# Altium schematic sheet MCU.SchDoc
size A; SheetNumber: 2; SheetTotal: 9
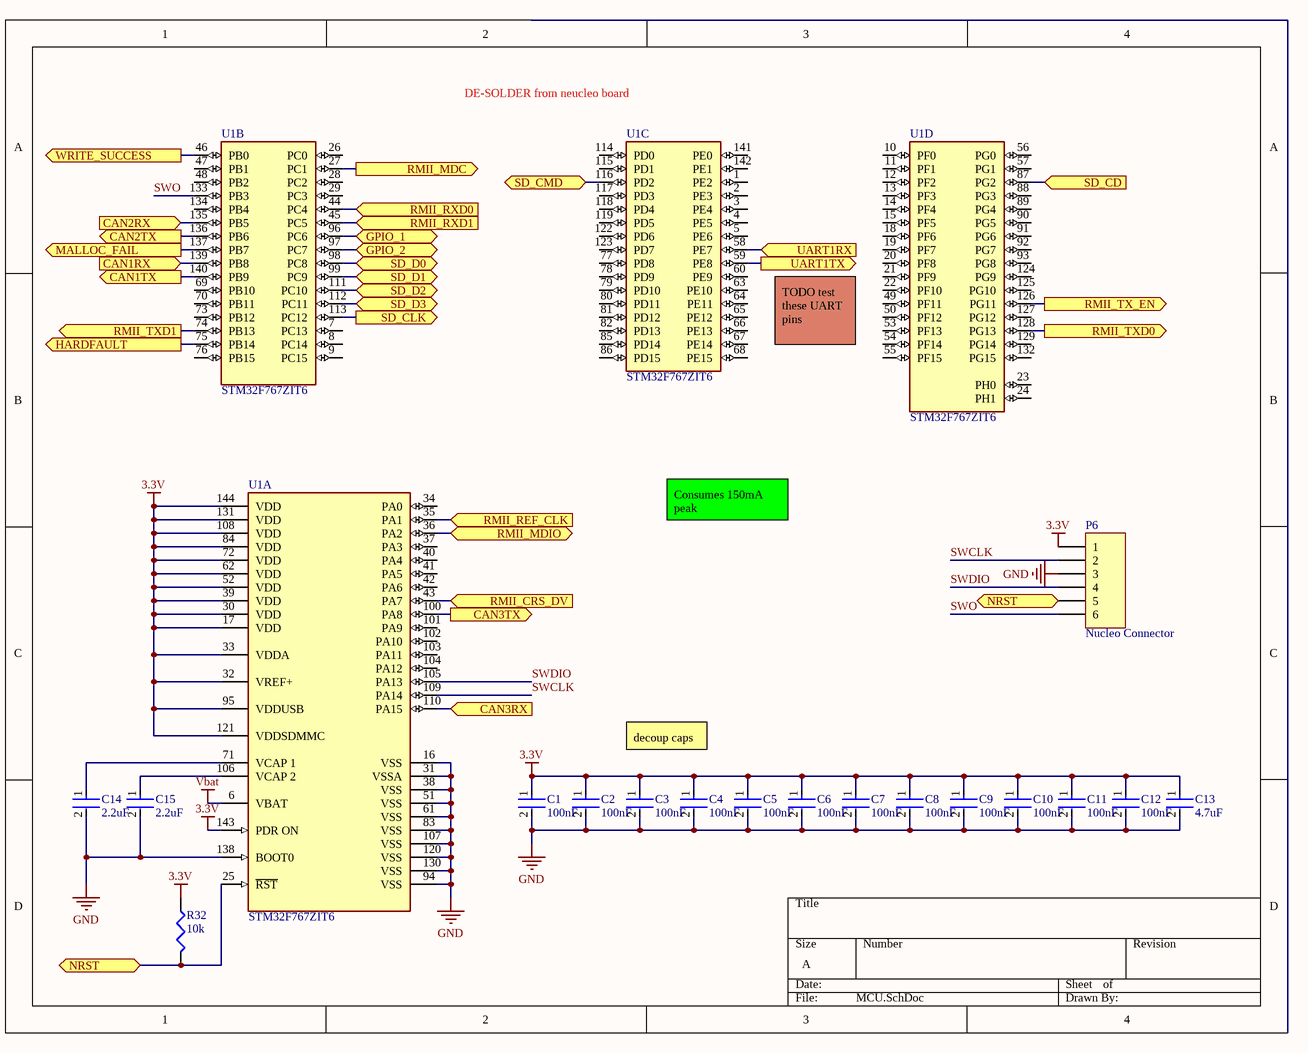
[diagram p0: MCU.SchDoc]

## Parts
C1  100nF  [FP-C0603C-CF-MFG]
C2  100nF  [FP-C0603C-CF-MFG]
C3  100nF  [FP-C0603C-CF-MFG]
C4  100nF  [FP-C0603C-CF-MFG]
C5  100nF  [FP-C0603C-CF-MFG]
C6  100nF  [FP-C0603C-CF-MFG]
C7  100nF  [FP-C0603C-CF-MFG]
C8  100nF  [FP-C0603C-CF-MFG]
C9  100nF  [FP-C0603C-CF-MFG]
C10  100nF  [FP-C0603C-CF-MFG]
C11  100nF  [FP-C0603C-CF-MFG]
C12  100nF  [FP-C0603C-CF-MFG]
C13  4.7uF  [FP-C0603C-CF-MFG]
C14  2.2uF  [FP-C0603C-CF-MFG]
C15  2.2uF  [FP-C0603C-CF-MFG]
P6  Nucleo Connector  [HDR1X6]
R32  10k  [J1-0603]
U1  STM32F767ZIT6  [FP-LQFP144-1A-MFG]  (parts A,B,C,D of 4)

## Ports
CAN1RX (in), CAN1TX (out), CAN2RX (in), CAN2TX (out), CAN3RX (in), CAN3TX (out), GPIO_1 (bidir), GPIO_2 (bidir), HARDFAULT (out), MALLOC_FAIL (out), NRST (bidir), RMII_CRS_DV (in), RMII_MDC (out), RMII_MDIO (bidir), RMII_REF_CLK (in), RMII_RXD0 (in), RMII_RXD1 (in), RMII_TX_EN (out), RMII_TXD0 (out), RMII_TXD1 (out), SD_CD (in), SD_CLK (out), SD_CMD (bidir), SD_D0 (bidir), SD_D1 (bidir), SD_D2 (bidir), SD_D3 (bidir), UART1RX (in), UART1TX (out), WRITE_SUCCESS (out)

## Nets
3.3V: C1.1 C2.1 C3.1 C4.1 C5.1 C6.1 C7.1 C8.1 C9.1 C10.1 C11.1 C12.1 C13.1 P6.1 R32.1 U1.17(VDD) U1.30(VDD) U1.32(VREF+) U1.33(VDDA) U1.39(VDD) U1.52(VDD) U1.62(VDD) U1.72(VDD) U1.84(VDD) U1.95(VDDUSB) U1.108(VDD) U1.121(VDDSDMMC) U1.131(VDD) U1.143(PDR_ON) U1.144(VDD)
GND: C1.2 C2.2 C3.2 C4.2 C5.2 C6.2 C7.2 C8.2 C9.2 C10.2 C11.2 C12.2 C13.2 C14.2 C15.2 P6.3 U1.16(VSS) U1.31(VSSA) U1.38(VSS) U1.51(VSS) U1.61(VSS) U1.83(VSS) U1.94(VSS) U1.107(VSS) U1.120(VSS) U1.130(VSS) U1.138(BOOT0)
Vbat: U1.6(VBAT)
CAN1RX: U1.139(PB8) ; port CAN1RX
CAN1TX: U1.140(PB9) ; port CAN1TX
CAN2RX: U1.135(PB5) ; port CAN2RX
CAN2TX: U1.136(PB6) ; port CAN2TX
CAN3RX: U1.110(PA15) ; port CAN3RX
CAN3TX: U1.100(PA8) ; port CAN3TX
GPIO_1: U1.96(PC6) ; port GPIO_1
GPIO_2: U1.97(PC7) ; port GPIO_2
HARDFAULT: U1.75(PB14) ; port HARDFAULT
MALLOC_FAIL: U1.137(PB7) ; port MALLOC_FAIL
NRST: P6.5 R32.2 U1.25(~{RST}) ; port NRST
RMII_CRS_DV: U1.43(PA7) ; port RMII_CRS_DV
RMII_MDC: U1.27(PC1) ; port RMII_MDC
RMII_MDIO: U1.36(PA2) ; port RMII_MDIO
RMII_REF_CLK: U1.35(PA1) ; port RMII_REF_CLK
RMII_RXD0: U1.44(PC4) ; port RMII_RXD0
RMII_RXD1: U1.45(PC5) ; port RMII_RXD1
RMII_TX_EN: U1.126(PG11) ; port RMII_TX_EN
RMII_TXD0: U1.128(PG13) ; port RMII_TXD0
RMII_TXD1: U1.74(PB13) ; port RMII_TXD1
SD_CD: U1.87(PG2) ; port SD_CD
SD_CLK: U1.113(PC12) ; port SD_CLK
SD_CMD: U1.116(PD2) ; port SD_CMD
SD_D0: U1.98(PC8) ; port SD_D0
SD_D1: U1.99(PC9) ; port SD_D1
SD_D2: U1.111(PC10) ; port SD_D2
SD_D3: U1.112(PC11) ; port SD_D3
SWCLK: P6.2 U1.109(PA14)
SWDIO: P6.4 U1.105(PA13)
SWO: P6.6 U1.133(PB3)
UART1RX: U1.58(PE7) ; port UART1RX
UART1TX: U1.59(PE8) ; port UART1TX
WRITE_SUCCESS: U1.46(PB0) ; port WRITE_SUCCESS
NetC14_1: C14.1 U1.71(VCAP_1)
NetC15_1: C15.1 U1.106(VCAP_2)

Not connected (* = marked no-connect by the designer): U1 1(PE2) 2(PE3) 3(PE4) 4(PE5) 5(PE6) 7(PC13) 8(PC14) 9(PC15) 10(PF0) 11(PF1) 12(PF2) 13(PF3) 14(PF4) 15(PF5) 18(PF6) 19(PF7) 20(PF8) 21(PF9) 22(PF10) 23(PH0) 24(PH1) 26(PC0) 28(PC2) 29(PC3) 34(PA0) 37(PA3) 40(PA4) 41(PA5) 42(PA6) 47(PB1) 48(PB2) 49(PF11) 50(PF12) 53(PF13) 54(PF14) 55(PF15) 56(PG0) 57(PG1) 60(PE9) 63(PE10) 64(PE11) 65(PE12) 66(PE13) 67(PE14) 68(PE15) 69(PB10) 70(PB11) 73(PB12) 76(PB15) 77(PD8) 78(PD9) 79(PD10) 80(PD11) 81(PD12) 82(PD13) 85(PD14) 86(PD15) 88(PG3) 89(PG4) 90(PG5) 91(PG6) 92(PG7) 93(PG8) 101(PA9) 102(PA10) 103(PA11) 104(PA12) 114(PD0) 115(PD1) 117(PD3) 118(PD4) 119(PD5) 122(PD6) 123(PD7) 124(PG9) 125(PG10) 127(PG12) 129(PG14) 132(PG15) 134(PB4) 141(PE0) 142(PE1)

## Notes on the sheet
- DE-SOLDER from neucleo board
- TODO test these UART pins
- Consumes 150mA peak
- decoup caps

## Library data of the parts
C1-C15 = CMP-2006-03061-2: Any 0603 Cap is fine here; Manufacturer: KEMET; Manufacturer Part Number: C0603C104K5RACTU; Tolerance: 0.1; Temperature Coefficient: 30ppm/°C; Material: Ceramic; Automotive Grade: Grade 1; Voltage Rating: 50 V; Value: 0.10 μF; Temperature Characteristic: X7R; Temperature: -55°C to +125°C; RoHS: TRUE; Temperature Range High: +125°C; Lead Free: Yes; Octopart: https://octopart.com/c0603c104k5ractu-kemet-139244; Digikey Description: CAP CER 0.1UF 50V X7R 0603; Category: Cap; Package: C0603C-CF; ComponentLink2Description: Datasheet; Temperature Range Low: -55°C; Device Class L1: Passive Components; Automotive: Yes; Device Class L3: Ceramic Capacitors; ComponentLink2URL: https://api.kemet.com/component-edge/download/datasheet/C0603C100J5GACAUTO.pdf; Capacitance: 0.10 μF; Device Class L2: Capacitors; Height: 0.87mm
P6 = Header 6: Header, 6-Pin; LatestRevisionDate: 17-Jul-2002; LatestRevisionNote: Re-released for DXP Platform.; Publisher: Altium Limited
R32 = Res3: Resistor; Published: 8-Jun-2000; LatestRevisionDate: 29-May-2009; LatestRevisionNote: IPC-7351 Footprint Added.; PackageReference: J1-0603; Publisher: Altium Limited; PackageDescription: Chip Resistor; Value: 10K
U1 = CMP-12105-000074-1: IC MCU 32BIT 2MB FLASH 144LQFP; Manufacturer: STMicroelectronics; Ram Size: 512KBytes; Number Of I/Os: 114; Core Architecture: ARM Cortex-M7; Memory Size: 2048KBytes; Standoff Height: 0.05mm; Number Of Adc Channels: 24; Max Supply Voltage: 3.6V; Number Of Pwm Channels: 4; Min Supply Voltage: 1.7V; Max Junction Temp: +105°C; Number Of Timers/Counters: 15; Number Of Usb Channels: 1; Interface: I2C,SPI,UART,USART,EBI/EMI,CAN,USB,LIN,IrDA,Ethernet,I2S; Frequency: 216MHz; Data Bus Width: 32bits; Number Of Spi Channels: 6; Number Of A/D Converters: 3; Octopart: https://octopart.com/stm32f767zit6-stmicroelectronics-70527068; Category: IC; Device Class L2: Embedded Processors and Controllers; Package: LQFP144-1A; RoHS: TRUE; Digikey Description: IC MCU 32BIT 2MB FLASH 144LQFP; ComponentLink2Description: Datasheet; Automotive: No; Mouser Description: ARM Microcontrollers - MCU High-performance and DSP with FPU, ARM Cortex-M7 MCU with 2 Mbytes Flash, 216 MHz CPU, Art Accelerator, L1 cache, SDRAM,; Ambient Temperature Range Low: -40°C; Ambient Temperature Range High: +85°C; Memory Type: FLASH; ComponentLink2URL: https://www.st.com/resource/en/datasheet/stm32f767zi.pdf; Number Of Uart Channels: 4; Temperature: -40°C to +85°C; Device Class L3: Microcontrollers; Device Class L1: Integrated Circuits (ICs); Temperature Range Low: -40°C; Temperature Range High: +85°C; Lead Free: Yes; Number Of I2C Channels: 4; Number Of Ethernet Channels: 1; Height: 1.6mm; Number Of Cores: 1; Manufacturer Part Number: STM32F767ZIT6; Ipc Land Pattern Name: QFP50P2200X2200X160-144